# EAGLE schematic qPCR_pcb_breakout_TLC5940PWPR (EAGLE 9.6.1)
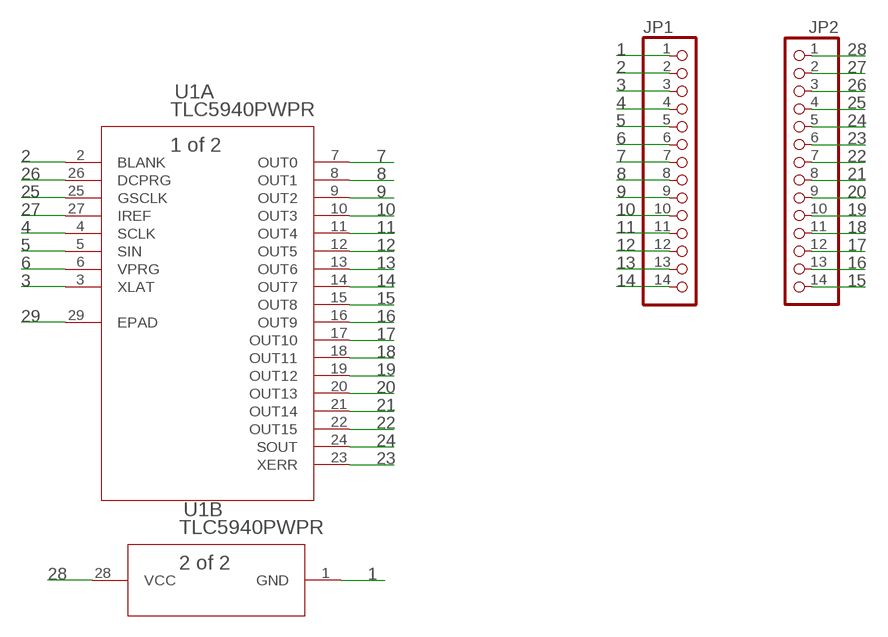
[diagram p0: schematic, sheet 1]

## Parts
JP1  PINHD-1X14  [1X14]
JP2  PINHD-1X14  [1X14]
U1  TLC5940PWPR  [PWP28_6P17X2P4]

## Nets
1: JP1.1 U1.1(B:GND)
2: JP1.2 U1.2(A:BLANK)
3: JP1.3 U1.3(A:XLAT)
4: JP1.4 U1.4(A:SCLK)
5: JP1.5 U1.5(A:SIN)
6: JP1.6 U1.6(A:VPRG)
7: JP1.7 U1.7(A:OUT0)
8: JP1.8 U1.8(A:OUT1)
9: JP1.9 U1.9(A:OUT2)
10: JP1.10 U1.10(A:OUT3)
11: JP1.11 U1.11(A:OUT4)
12: JP1.12 U1.12(A:OUT5)
13: JP1.13 U1.13(A:OUT6)
14: JP1.14 U1.14(A:OUT7)
15: JP2.14 U1.15(A:OUT8)
16: JP2.13 U1.16(A:OUT9)
17: JP2.12 U1.17(A:OUT10)
18: JP2.11 U1.18(A:OUT11)
19: JP2.10 U1.19(A:OUT12)
20: JP2.9 U1.20(A:OUT13)
21: JP2.8 U1.21(A:OUT14)
22: JP2.7 U1.22(A:OUT15)
23: JP2.6 U1.23(A:XERR)
24: JP2.5 U1.24(A:SOUT)
25: JP2.4 U1.25(A:GSCLK)
26: JP2.3 U1.26(A:DCPRG)
27: JP2.2 U1.27(A:IREF)
28: JP2.1 U1.28(B:VCC)
29: U1.29(A:EPAD)

## Library data of the parts
JP1 JP2 = pinhead:PINHD-1X14: PIN HEADER
U1 = Ninja_qPCR:TLC5940PWPR; BUILT_BY: EMA_UL_Team; MANUFACTURER: Texas Instruments; MANUFACTURER_PART_NUMBER: TLC5940PWPR; SOURCELIBRARY: TI_2014-06-19; VENDOR: Texas Instruments